# EAGLE design card (EAGLE 7.7.0)
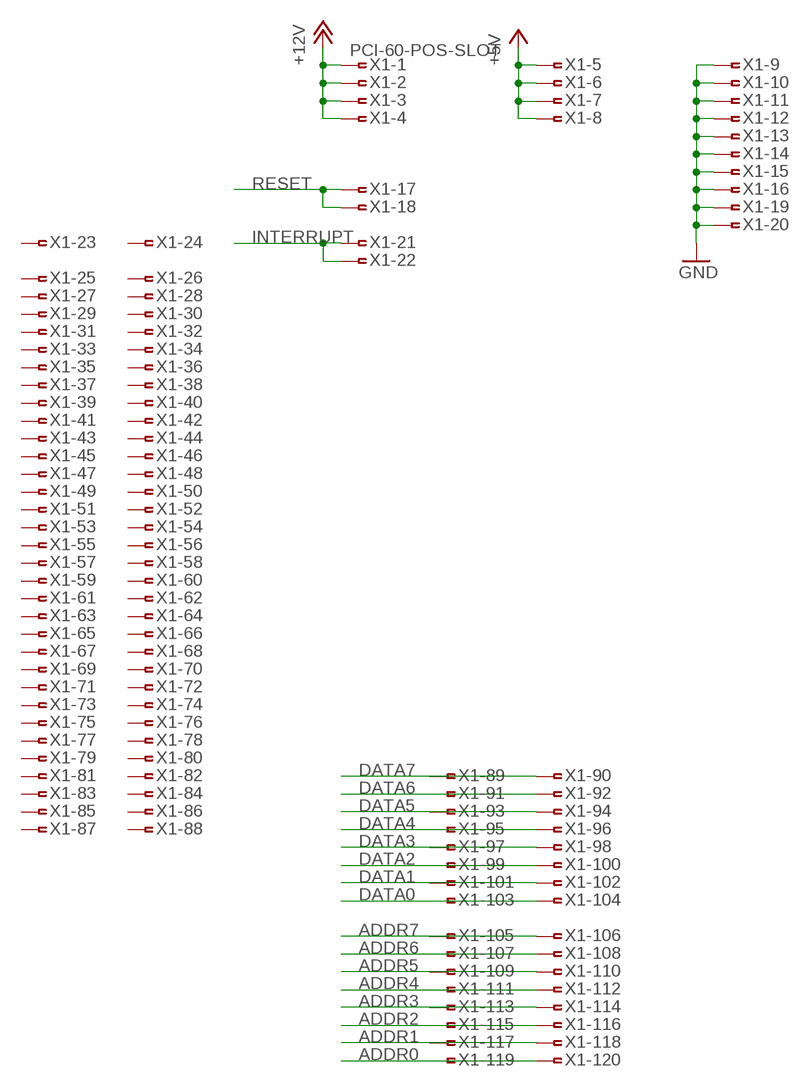
[diagram p0: schematic, sheet 1]

## Parts
X1  PCI-60-POS-SLOT  [PCI-SLOT-60]

## Nets
+5V: X1.5 X1.6 X1.7 X1.8
+12V: X1.1 X1.2 X1.3 X1.4
ADDR0: X1.119 X1.120
ADDR1: X1.117 X1.118
ADDR2: X1.115 X1.116
ADDR3: X1.113 X1.114
ADDR4: X1.111 X1.112
ADDR5: X1.109 X1.110
ADDR6: X1.107 X1.108
ADDR7: X1.105 X1.106
DATA0: X1.103 X1.104
DATA1: X1.101 X1.102
DATA2: X1.99 X1.100
DATA3: X1.97 X1.98
DATA4: X1.95 X1.96
DATA5: X1.93 X1.94
DATA6: X1.91 X1.92
DATA7: X1.89 X1.90
GND: X1.9 X1.10 X1.11 X1.12 X1.13 X1.14 X1.15 X1.16 X1.19 X1.20
INTERRUPT: X1.21 X1.22
RESET: X1.17 X1.18
Unconnected: X1.23 X1.24 X1.25 X1.26 X1.27 X1.28 X1.29 X1.30 X1.31 X1.32 X1.33 X1.34 X1.35 X1.36 X1.37 X1.38 X1.39 X1.40 X1.41 X1.42 X1.43 X1.44 X1.45 X1.46 X1.47 X1.48 X1.49 X1.50 X1.51 X1.52 X1.53 X1.54 X1.55 X1.56 X1.57 X1.58 X1.59 X1.60 X1.61 X1.62 X1.63 X1.64 X1.65 X1.66 X1.67 X1.68 X1.69 X1.70 X1.71 X1.72 X1.73 X1.74 X1.75 X1.76 X1.77 X1.78 X1.79 X1.80 X1.81 X1.82 X1.83 X1.84 X1.85 X1.86 X1.87 X1.88

## Library data of the parts
X1 = con-amp:PCI-60-POS: PCI-SLOT 60 Dual Position 0.05 Series Standard Edge Source: http://catalog.tycoelectronics.com .. ENG_CD_145167_F.pdf

## Board
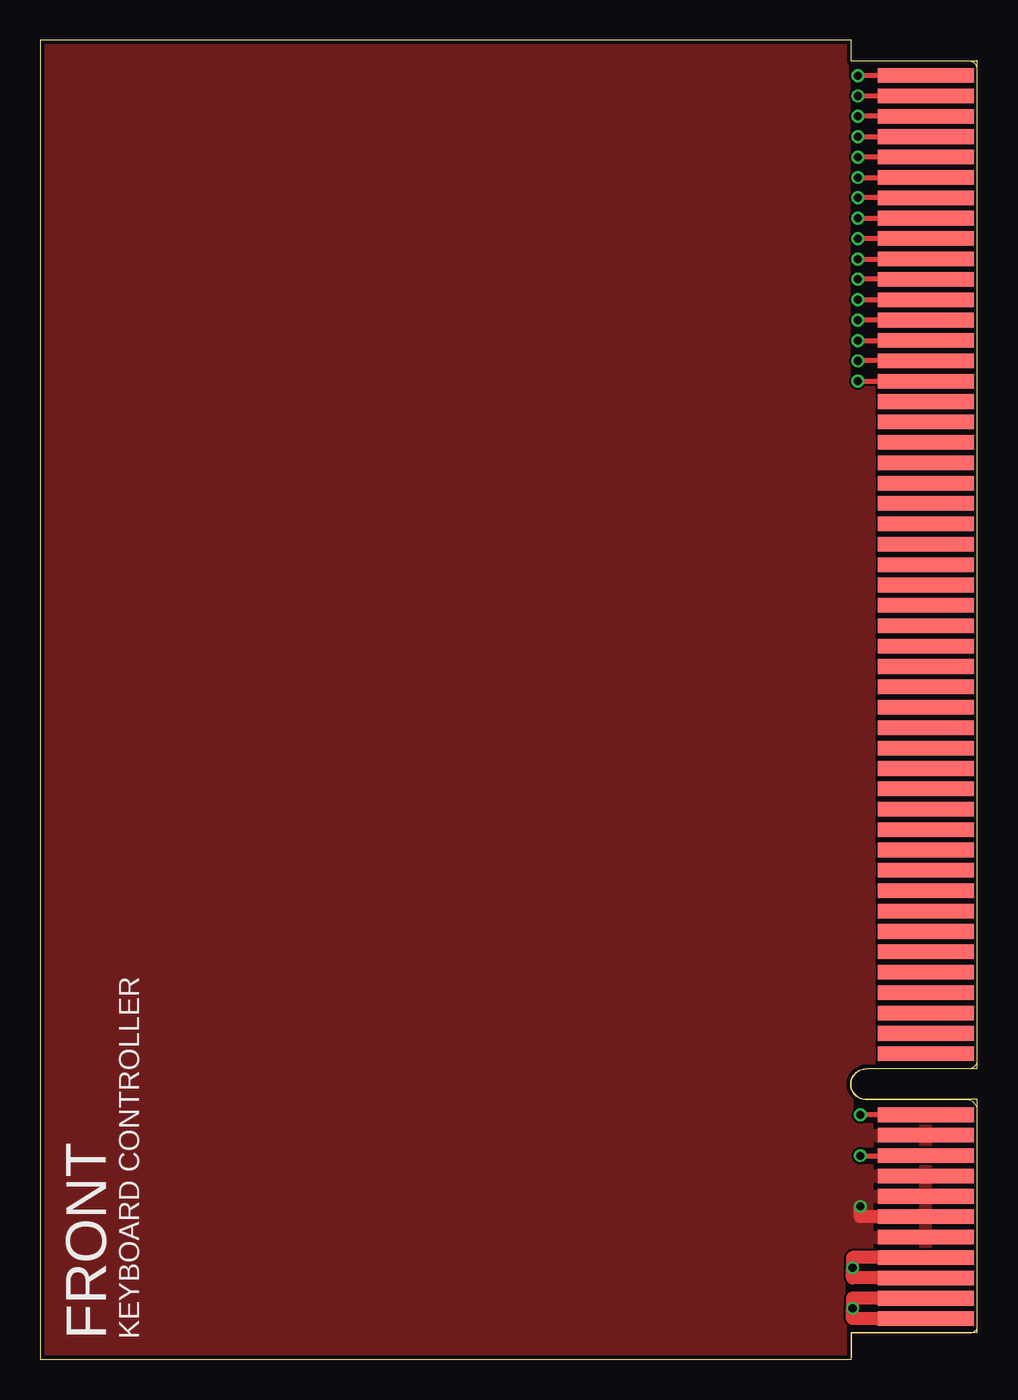
[diagram p1: board, top side]
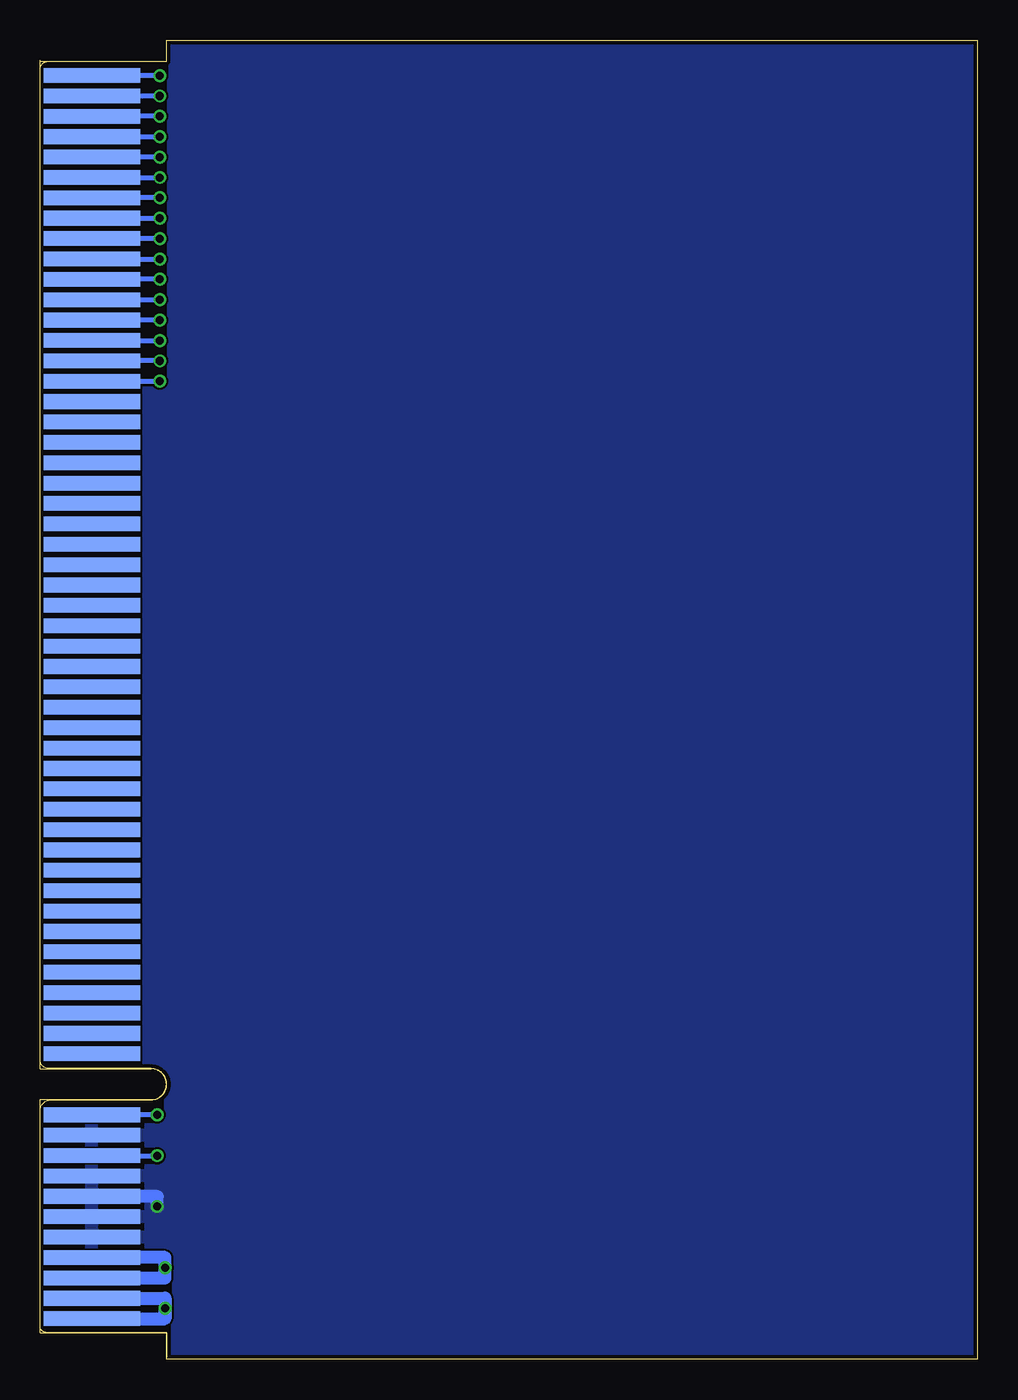
[diagram p2: board, bottom side, seen from below]

Size 58.42 x 82.22 mm. Coordinates in mm from the lower left corner, seen from the top.
Outline: 0,0 50.55,0 50.55,1.67 58.01,1.67 arc90 58.42,2.07 58.42,15.48 arc90 57.73,16.18 51.5,16.18 arc-180 51.5,18.12 57.87,18.12 arc90 58.42,18.68 58.42,80.38 arc90 57.9,80.91 50.55,80.91 50.55,82.22 0,82.22 0,0
Copper layers (1*16): Top 0.035mm / dielectric 1.5mm / Bottom 0.035mm
Design rules "dirtypcbs": minimum track width 5mil, minimum drill 12mil, track to track 5mil, track to pad 5mil, pad to pad 5mil, via to via 5mil, smd to smd 0mil, copper to edge 10mil, drill to drill 10mil, minimum pad ring 10mil, minimum via ring 6mil, stop-mask expansion 2mil, vias tented up to drill 25mil, thermal gap 10mil

### Footprints (pad centres in the part's own frame; a part is rotated, then mirrored left to right if it is on the bottom)
PCI-SLOT-60 = smd 0.91 x 6: 1 0,3.22; 3 1.27,3.22; 5 2.54,3.22; 7 3.81,3.22; 9 5.08,3.22; 11 6.35,3.22; 13 7.62,3.22; 15 8.89,3.22; 17 10.16,3.22; 19 11.43,3.22; 21 12.7,3.22; 23 16.51,3.22; 25 17.78,3.22; 27 19.05,3.22; 29 20.32,3.22; 31 21.59,3.22; 33 22.86,3.22; 35 24.13,3.22; 37 25.4,3.22; 39 26.67,3.22; 41 27.94,3.22; 43 29.21,3.22; 45 30.48,3.22; 47 31.75,3.22; 49 33.02,3.22; 51 34.29,3.22; 53 35.56,3.22; 55 36.83,3.22; 57 38.1,3.22; 59 39.37,3.22; 61 40.64,3.22; 63 41.91,3.22; 65 43.18,3.22; 67 44.45,3.22; 69 45.72,3.22; 71 46.99,3.22; 73 48.26,3.22; 75 49.53,3.22; 77 50.8,3.22; 79 52.07,3.22; 81 53.34,3.22; 83 54.61,3.22; 85 55.88,3.22; 87 57.15,3.22; 89 58.42,3.22; 91 59.69,3.22; 93 60.96,3.22; 95 62.23,3.22; 97 63.5,3.22; 99 64.77,3.22; 101 66.04,3.22; 103 67.31,3.22; 105 68.58,3.22; 107 69.85,3.22; 109 71.12,3.22; 111 72.39,3.22; 113 73.66,3.22; 115 74.93,3.22; 117 76.2,3.22; 119 77.47,3.22 | smd 0.91 x 6 bottom: 2 0,3.22; 4 1.27,3.22; 6 2.54,3.22; 8 3.81,3.22; 10 5.08,3.22; 12 6.35,3.22; 14 7.62,3.22; 16 8.89,3.22; 18 10.16,3.22; 20 11.43,3.22; 22 12.7,3.22; 24 16.51,3.22; 26 17.78,3.22; 28 19.05,3.22; 30 20.32,3.22; 32 21.59,3.22; 34 22.86,3.22; 36 24.13,3.22; 38 25.4,3.22; 40 26.67,3.22; 42 27.94,3.22; 44 29.21,3.22; 46 30.48,3.22; 48 31.75,3.22; 50 33.02,3.22; 52 34.29,3.22; 54 35.56,3.22; 56 36.83,3.22; 58 38.1,3.22; 60 39.37,3.22; 62 40.64,3.22; 64 41.91,3.22; 66 43.18,3.22; 68 44.45,3.22; 70 45.72,3.22; 72 46.99,3.22; 74 48.26,3.22; 76 49.53,3.22; 78 50.8,3.22; 80 52.07,3.22; 82 53.34,3.22; 84 54.61,3.22; 86 55.88,3.22; 88 57.15,3.22; 90 58.42,3.22; 92 59.69,3.22; 94 60.96,3.22; 96 62.23,3.22; 98 63.5,3.22; 100 64.77,3.22; 102 66.04,3.22; 104 67.31,3.22; 106 68.58,3.22; 108 69.85,3.22; 110 71.12,3.22; 112 72.39,3.22; 114 73.66,3.22; 116 74.93,3.22; 118 76.2,3.22; 120 77.47,3.22

### Placement (x,y rotation side)
X1  58.42,2.54 90 top

### Tracks (layer width: path | path; a pad name or v marks a point on that pad's centre or on a via)
+5V  (via drill 0.5)
  Top 0.813: X1.6 50.64,5.08 v50.64,5.71 50.64,6.35 X1.7
  Bottom 0.813: X1.7 50.64,6.35 v50.64,5.71 50.64,5.08 X1.6
+12V  (via drill 0.5)
  Top 0.813: X1.2 50.64,2.54 v50.64,3.17 50.64,3.81 X1.4
  Bottom 0.813: X1.2 50.64,2.54 50.64,3.02 v50.64,3.17 50.64,3.81 X1.4
ADDR0  (via drill 0.5)
  Top 0.305: X1.120 v50.96,80.01
  Bottom 0.305: v50.96,80.01 X1.120
ADDR1  (via drill 0.5)
  Top 0.305: v50.96,78.74 X1.117
  Bottom 0.305: X1.117 v50.96,78.74
ADDR2  (via drill 0.5)
  Top 0.305: X1.116 v50.96,77.47
  Bottom 0.305: v50.96,77.47 X1.116
ADDR3  (via drill 0.5)
  Top 0.305: v50.96,76.2 X1.113
  Bottom 0.305: X1.113 v50.96,76.2
ADDR4  (via drill 0.5)
  Top 0.305: X1.112 v50.96,74.93
  Bottom 0.305: v50.96,74.93 X1.112
ADDR5  (via drill 0.5)
  Top 0.305: v50.96,73.66 X1.109
  Bottom 0.305: X1.109 v50.96,73.66
ADDR6  (via drill 0.5)
  Top 0.305: X1.108 v50.96,72.39
  Bottom 0.305: v50.96,72.39 X1.108
ADDR7  (via drill 0.5)
  Top 0.305: v50.96,71.12 X1.105
  Bottom 0.305: X1.105 v50.96,71.12
DATA0  (via drill 0.5)
  Top 0.305: X1.104 v50.96,69.85
  Bottom 0.305: v50.96,69.85 X1.104
DATA1  (via drill 0.5)
  Top 0.305: v50.96,68.58 X1.101
  Bottom 0.305: X1.101 v50.96,68.58
DATA2  (via drill 0.5)
  Top 0.305: X1.100 v50.96,67.31
  Bottom 0.305: v50.96,67.31 X1.100
DATA3  (via drill 0.5)
  Top 0.305: v50.96,66.04 X1.97
  Bottom 0.305: X1.97 v50.96,66.04
DATA4  (via drill 0.5)
  Top 0.305: X1.96 v50.96,64.77
  Bottom 0.305: v50.96,64.77 X1.96
DATA5  (via drill 0.5)
  Top 0.305: v50.96,63.5 X1.93
  Bottom 0.305: X1.93 v50.96,63.5
DATA6  (via drill 0.5)
  Top 0.305: X1.92 v50.96,62.23
  Bottom 0.305: v50.96,62.23 X1.92
DATA7  (via drill 0.5)
  Top 0.305: v50.96,60.96 X1.89
  Bottom 0.305: X1.89 v50.96,60.96
GND  (via drill 0.5)
  Top 0.813: X1.12 51.12,8.89 v51.12,9.53
  Bottom 0.813: v51.12,9.53 51.12,10.16 X1.14
  pour Bottom: 0,0 0,82.22 58.42,82.22 58.42,0
  pour Top: 0,82.22 0,0 58.42,0 58.42,82.22
INTERRUPT  (via drill 0.5)
  Top 0.305: X1.22 v51.12,15.24
  Bottom 0.305: v51.12,15.24 X1.22
RESET  (via drill 0.5)
  Top 0.305: v51.12,12.7 X1.18
  Bottom 0.305: X1.18 v51.12,12.7

### Text on the board
tNames: FRONT | KEYBOARD CONTROLLER